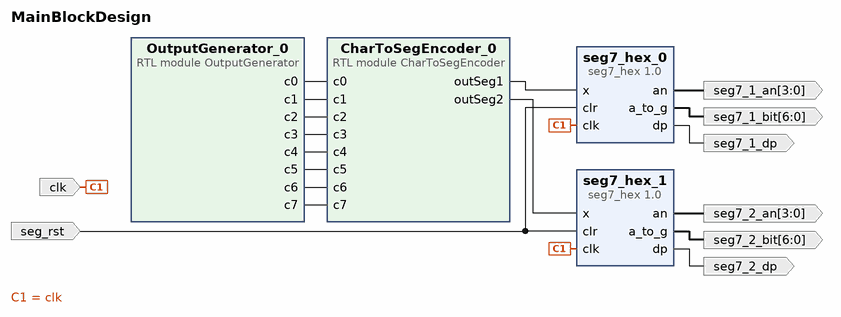
[diagram p0: block diagram of the top level]
# Vivado block design MainBlockDesign, xc7a35tcsg324-1, Vivado 2018.1
create_bd_design MainBlockDesign

create_bd_port -dir O -from 6 -to 0 seg7_2_bit
create_bd_port -dir O -from 3 -to 0 seg7_2_an
create_bd_port -dir O seg7_2_dp
create_bd_port -dir I clk
create_bd_port -dir O -from 6 -to 0 seg7_1_bit
create_bd_port -dir O -from 3 -to 0 seg7_1_an
create_bd_port -dir O seg7_1_dp
create_bd_port -dir I seg_rst

create_bd_cell -type ip -vlnv xilinx.com:user:seg7_hex:1.0 seg7_hex_1
create_bd_cell -type ip -vlnv xilinx.com:user:seg7_hex:1.0 seg7_hex_0
create_bd_cell -type module -reference CharToSegEncoder CharToSegEncoder_0
create_bd_cell -type module -reference OutputGenerator OutputGenerator_0

# ---- connections ----

connect_bd_net -net seg7_hex_0_a_to_g [get_bd_pins seg7_hex_1/a_to_g] [get_bd_ports seg7_2_bit]
connect_bd_net -net seg7_hex_0_an [get_bd_pins seg7_hex_1/an] [get_bd_ports seg7_2_an]
connect_bd_net -net seg7_hex_0_dp [get_bd_pins seg7_hex_1/dp] [get_bd_ports seg7_2_dp]
connect_bd_net [get_bd_ports clk] [get_bd_pins seg7_hex_1/clk] [get_bd_pins seg7_hex_0/clk]
connect_bd_net [get_bd_pins seg7_hex_0/a_to_g] [get_bd_ports seg7_1_bit]
connect_bd_net [get_bd_pins seg7_hex_0/an] [get_bd_ports seg7_1_an]
connect_bd_net [get_bd_pins seg7_hex_0/dp] [get_bd_ports seg7_1_dp]
connect_bd_net [get_bd_ports seg_rst] [get_bd_pins seg7_hex_0/clr] [get_bd_pins seg7_hex_1/clr]
connect_bd_net [get_bd_pins CharToSegEncoder_0/outSeg1] [get_bd_pins seg7_hex_0/x]
connect_bd_net [get_bd_pins CharToSegEncoder_0/outSeg2] [get_bd_pins seg7_hex_1/x]
connect_bd_net [get_bd_pins OutputGenerator_0/c0] [get_bd_pins CharToSegEncoder_0/c0]
connect_bd_net [get_bd_pins OutputGenerator_0/c1] [get_bd_pins CharToSegEncoder_0/c1]
connect_bd_net [get_bd_pins OutputGenerator_0/c2] [get_bd_pins CharToSegEncoder_0/c2]
connect_bd_net [get_bd_pins OutputGenerator_0/c3] [get_bd_pins CharToSegEncoder_0/c3]
connect_bd_net [get_bd_pins OutputGenerator_0/c4] [get_bd_pins CharToSegEncoder_0/c4]
connect_bd_net [get_bd_pins OutputGenerator_0/c5] [get_bd_pins CharToSegEncoder_0/c5]
connect_bd_net [get_bd_pins OutputGenerator_0/c6] [get_bd_pins CharToSegEncoder_0/c6]
connect_bd_net [get_bd_pins OutputGenerator_0/c7] [get_bd_pins CharToSegEncoder_0/c7]

validate_bd_design
save_bd_design
